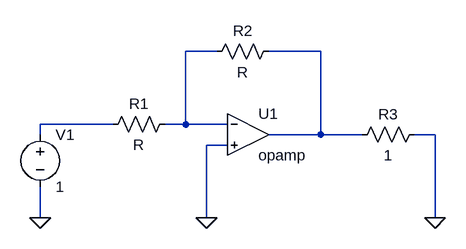
[diagram p0: schematic Draft1.asc]
Draft1.asc, the LTspice schematic file:
Version 4.1
SHEET 1 880 680
WIRE 112 32 64 32
WIRE 272 32 192 32
WIRE -48 144 -160 144
WIRE 64 144 64 32
WIRE 64 144 32 144
WIRE 128 144 64 144
WIRE -160 160 -160 144
WIRE 272 160 272 32
WIRE 272 160 192 160
WIRE 336 160 272 160
WIRE 448 160 416 160
WIRE 128 176 96 176
WIRE -160 288 -160 240
WIRE 96 288 96 176
WIRE 448 288 448 160
FLAG -160 288 0
FLAG 96 288 0
FLAG 448 288 0
SYMBOL OpAmps\\opamp 160 96 R0
SYMATTR InstName U1
SYMBOL res 48 128 R90
WINDOW 0 0 56 VBottom 2
WINDOW 3 32 56 VTop 2
SYMATTR InstName R1
SYMBOL res 208 16 R90
WINDOW 0 0 56 VBottom 2
WINDOW 3 32 56 VTop 2
SYMATTR InstName R2
SYMBOL voltage -160 144 R0
WINDOW 123 0 0 Left 0
WINDOW 39 0 0 Left 0
SYMATTR InstName V1
SYMATTR Value 1
SYMBOL res 432 144 R90
WINDOW 0 0 56 VBottom 2
WINDOW 3 32 56 VTop 2
SYMATTR InstName R3
SYMATTR Value 1

The netlist it stands for:
* Draft1.asc
X§U1 N001 0 N002 opamp Aol=100K GBW=10Meg  ; pins invin noninvin out
R1 N001 N003 R
R2 N002 N001 R
V1 N003 0 1
R3 0 N002 1
.backanno
.end